# EAGLE design BLE -- HM-10 $ ATtiny85 Combo -- v01 (EAGLE 6.4)
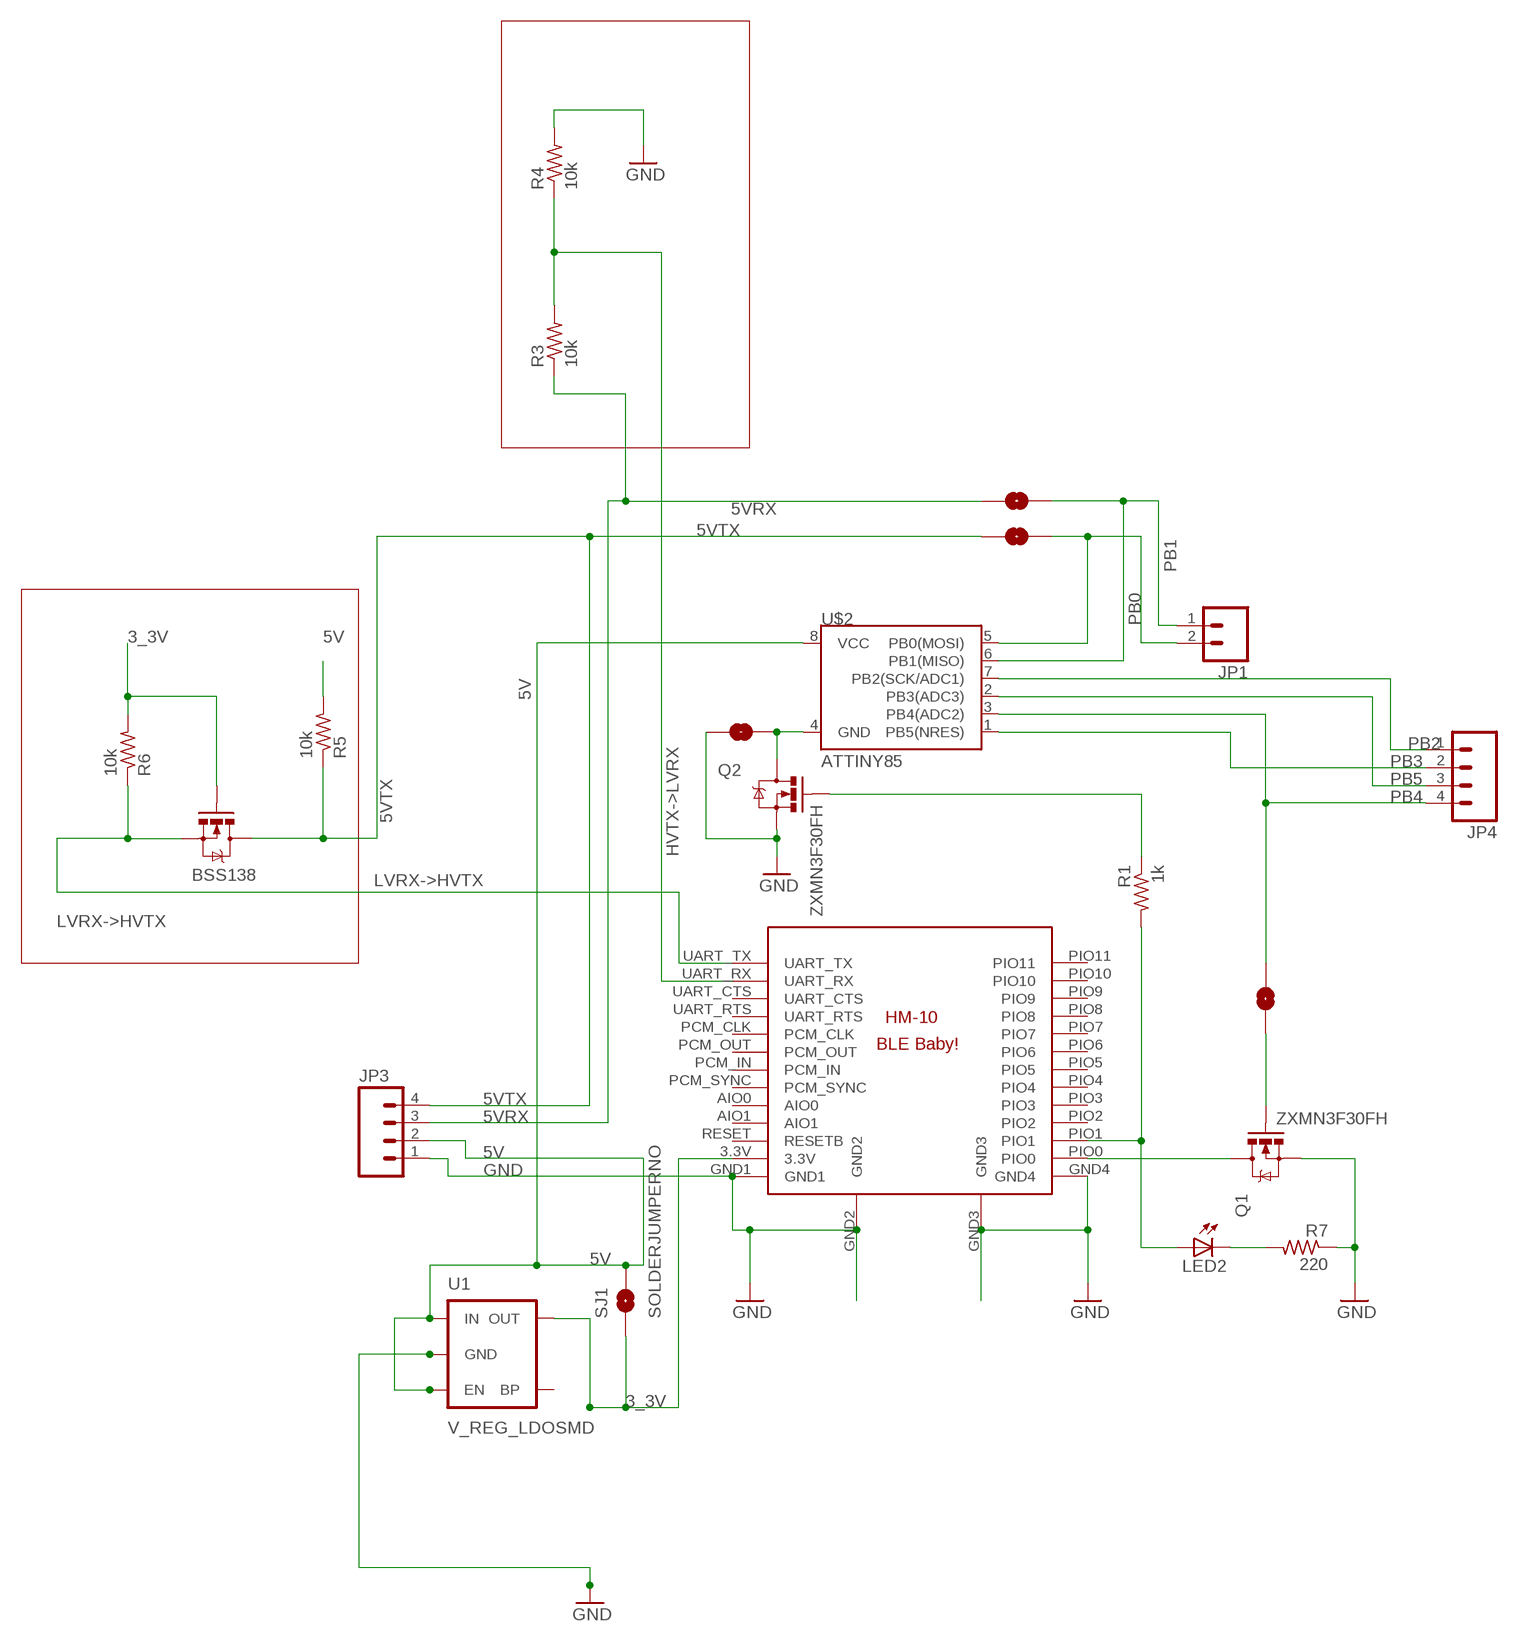
[diagram p0: schematic, sheet 1]

## Parts
BSS138  MOSFET-NCHANNELSMD  [SOT23-3]
JP1  M02PTH  [1X02]
JP3  M04PTH  [1X04]
JP4  M04PTH  [1X04]
LED2  LED0603  [LED-0603]
Q1  ZXMN3F30FH  MOSFET-NCHANNELSMD  [SOT23-3]
Q2  ZXMN3F30FH  MOSFET-NCHANNELSMD  [SOT23-3]
R1  1k  R-US_R0402  [R0402]
R3  10k  R-US_R0402  [R0402]
R4  10k  R-US_R0402  [R0402]
R5  10k  R-US_R0402  [R0402]
R6  10k  R-US_R0402  [R0402]
R7  220  R-US_R0402  [R0402]
SJ1  SOLDERJUMPERNO  [SJ_2S-NO]
SJ2  SOLDERJUMPERNO  [SJ_2S-NO]
SJ3  SOLDERJUMPERNO  [SJ_2S-NO]
SJ4  SOLDERJUMPERNO  [SJ_2S-NO]
SJ5  SOLDERJUMPERNO  [SJ_2S-NO]
U1  V_REG_LDOSMD  [SOT23-5]
U$1  BLE-HM10_NO_SPI  [BLE-HM10_NO_SPI]
U$2  ATTINY85  ATTINY45  [SO08-EIAJ]

## Nets
3_3V: BSS138.1(G) R6.2 SJ1.1 U1.5(OUT) U$1.3.3V
5V: JP3.2 R5.2 SJ1.2 U1.1(IN) U1.3(EN) U$2.8(VCC)
5VRX: JP3.3 R3.1 SJ3.2
5VTX: BSS138.3(D) JP3.4 R5.1 SJ2.2
GND: JP3.1 Q1.2(S) Q2.2(S) R4.2 R7.1 SJ5.1 U1.2(GND) U$1.GND1 U$1.GND2 U$1.GND3 U$1.GND4
HVTX->LVRX: R3.2 R4.1 U$1.UART_RX
LVRX->HVTX: BSS138.2(S) R6.1 U$1.UART_TX
N$1: Q1.1(G) SJ4.2
N$2: Q2.1(G) R1.1
N$3: LED2.A U$1.PIO1
N$12: Q2.3(D) SJ5.2 U$2.4(GND)
N$13: Q1.3(D) U$1.PIO0
N$26: LED2.C R7.2
PB0: JP1.2 SJ2.1 U$2.5(PB0(MOSI))
PB1: JP1.1 SJ3.1 U$2.6(PB1(MISO))
PB2: JP4.1 U$2.7(PB2(SCK/ADC1))
PB3: JP4.3 U$2.2(PB3(ADC3))
PB4: JP4.4 SJ4.1 U$2.3(PB4(ADC2))
PB5: JP4.2 U$2.1(PB5(NRES))
Unconnected: R1.2 U1.4(BP) U$1.AIO0 U$1.AIO1 U$1.PCM_CLK U$1.PCM_IN U$1.PCM_OUT U$1.PCM_SYNC U$1.PIO2 U$1.PIO3 U$1.PIO4 U$1.PIO5 U$1.PIO6 U$1.PIO7 U$1.PIO8 U$1.PIO9 U$1.PIO10 U$1.PIO11 U$1.RESET(RESETB) U$1.UART_CTS U$1.UART_RTS

## Library data of the parts
BSS138 Q1 Q2 = SparkFun:MOSFET-NCHANNEL
JP1 = SparkFun:M02: Header 2 Standard 2-pin 0.1" header. Use with straight break away headers (SKU : PRT-00116), right angle break away headers (PRT-00553), swiss pins (PRT-00743), machine pins (PRT-00117), and female headers (PRT-00115). Molex polarized connector foot print use with SKU : PRT-08233 with associated crimp pins and housings.
JP3 JP4 = SparkFun:M04: Header 4 Standard 4-pin 0.1" header. Use with straight break away headers (SKU : PRT-00116), right angle break away headers (PRT-00553), swiss pins (PRT-00743), machine pins (PRT-00117), and female headers (PRT-00115). Molex polarized connector foot print use with SKU : PRT-08231 with associated crimp pins and housings. 1MM SMD Version SKU: PRT-10208
LED2 = SparkFun:LED: LEDs Standard schematic elements and footprints for 5mm, 3mm, 1206, and 0603 sized LEDs. 5mm - Spark Fun Electronics SKU : COM-00529 (and others)
R1 R3-R7 = resistor:R-US_: RESISTOR, American symbol
SJ1-SJ5 = SparkFun:SOLDERJUMPER: Solder Jumper Standard SMD solder jumper. Used to automate production. Two varients : Normally Open and Normally Closed are the same, but have different paste layers. NC will have a large amount of paste and should jumper during reflow.
U1 = SparkFun:V_REG_LDO: Voltage Regulator LDO Standard 150mA LDO voltage regulator in SOT-23 layout. Micrel part MIC5205. BP (by-pass) pin is used to lower output noise with 470pF cap.
U$1 = Random parts:BLE-HM10_NO_SPI
U$2 = SparkFun:ATTINY45: Atmel ATTiny45

## Board
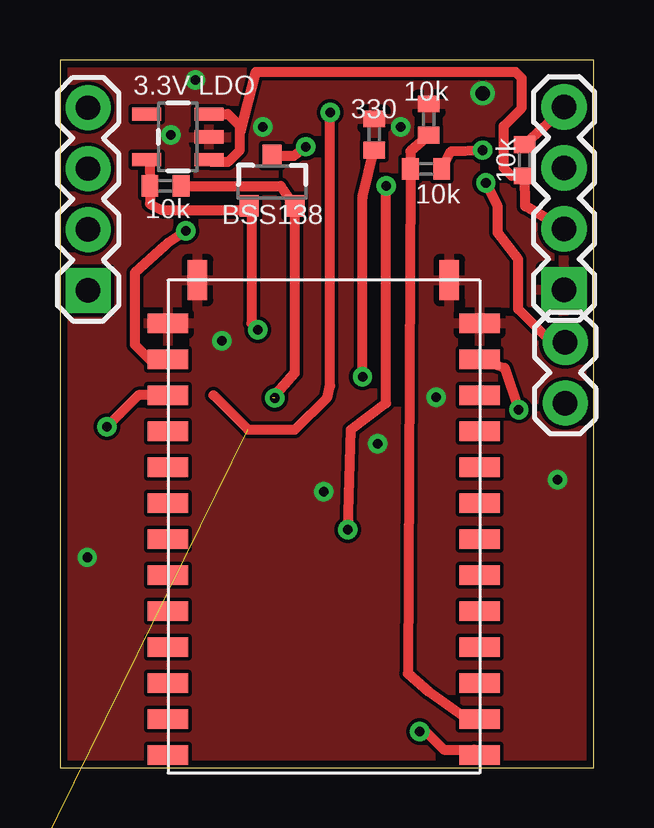
[diagram p1: board, top side]
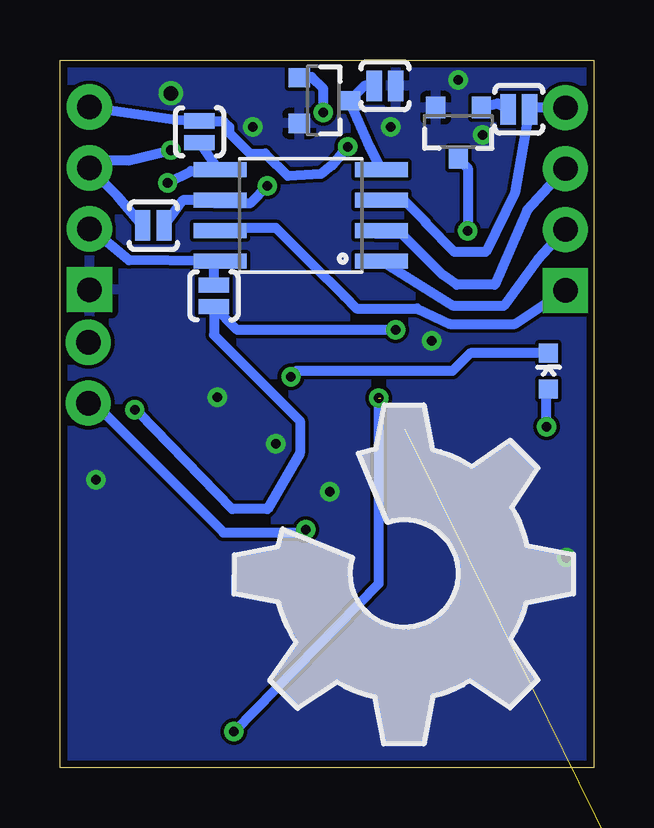
[diagram p2: board, bottom side, seen from below]

Size 22.25 x 29.5 mm. Coordinates in mm from the lower left corner, seen from the top.
Outline: 0,0 22.25,0 22.25,29.5 0,29.5 0,0
Copper layers (1*16): Top 0.035mm / dielectric 1.5mm / Bottom 0.035mm
Design rules "default *": minimum track width 10mil, minimum drill 24mil, track to track 6mil, track to pad 6mil, pad to pad 6mil, via to via 6mil, smd to smd 6mil, copper to edge 12mil, drill to drill 8mil, minimum pad ring 10mil, minimum via ring 8mil, stop-mask expansion 4mil, vias tented up to drill 0.6mm, thermal gap 10mil

### Footprints (pad centres in the part's own frame; a part is rotated, then mirrored left to right if it is on the bottom)
SOT23-3 = smd 0.8 x 0.9: 1 -0.95,-1; 2 0.95,-1; 3 0,1.1
1X02 = drill 1.016 pad 1.88: 1 0,0; 2 2.54,0
1X04 = drill 1.016 pad 1.88 square: 1 0,0 | drill 1.016 pad 1.88: 2 2.54,0; 3 5.08,0; 4 7.62,0
LED-0603 = smd 0.8 x 0.8: A 0,-0.75; C 0,0.75
R0402 = smd 0.7 x 0.9: 1 -0.65,0; 2 0.65,0
SJ_2S-NO = smd 0.635 x 1.27: 1 -0.45,0; 2 0.45,0
SOT23-5 = smd 0.55 x 1.2: 1 -0.95,-1.3; 2 0,-1.3; 3 0.95,-1.3; 4 0.95,1.3; 5 -0.95,1.3
BLE-HM10_NO_SPI = smd 1.676 x 0.813: 3.3V 0,-17.03; AIO0 0,-12.53; AIO1 0,-14.03; GND1 0,-18.53; GND4 13,-18.53; PCM_CLK 0,-6.53; PCM_IN 0,-9.53; PCM_OUT 0,-8.03; PCM_SYNC 0,-11.03; PIO0 13,-17.03; PIO1 13,-15.53; PIO2 13,-14.03; PIO3 13,-12.53; PIO4 13,-11.03; PIO5 13,-9.53; PIO6 13,-8.03; PIO7 13,-6.53; PIO8 13,-5.03; PIO9 13,-3.53; PIO10 13,-2.03; PIO11 13,-0.53; RESET 0,-15.53; UART_CTS 0,-3.53; UART_RTS 0,-5.03; UART_RX 0,-2.03; UART_TX 0,-0.53 | smd 0.813 x 1.676: GND2 1.27,-20.32; GND3 11.77,-20.32
SO08-EIAJ = smd 0.61 x 2.21: 1 -1.905,-3.378; 2 -0.635,-3.378; 3 0.635,-3.378; 4 1.905,-3.378; 5 1.905,3.353; 6 0.635,3.353; 7 -0.635,3.353; 8 -1.905,3.353

### Placement (x,y rotation side)
BSS138  8.84,24.41 0 top
JP1  21.07,15.19 90 top
JP3  21.02,19.92 90 top
JP4  1.17,19.89 90 top
LED2  1.88,16.53 0 bottom
Q1  5.63,26.52 180 bottom
Q2  11.27,27.81 270 bottom
R1  -0.73,-4.66 0 top  (outside the outline)
R3  15.27,24.95 180 top
R4  15.38,27.02 90 top
R5  19.38,25.32 270 top
R6  4.4,24.25 180 top
R7  13.1,26.39 270 top
SJ1  15.83,19.67 90 bottom
SJ2  16.43,26.5 90 bottom
SJ3  18.36,22.59 180 bottom
SJ4  3.12,27.44 180 bottom
SJ5  8.7,28.42 180 bottom
U1  4.92,26.29 90 top
U$1  17.5,0 180 top
U$2  12.21,23.02 90 bottom
U$3  [OSHW_FILLX500_NOTEXT]  6.86,17.03 225 bottom

### Tracks (layer width: path | path; a pad name or v marks a point on that pad's centre or on a via)
3_3V  (via drill 0.4)
  Top 0.254: v19.13,14.92 arc90 19.11,14.95 18.99,14.95
  Top 0.406: U1.5 3.74,25.23 R6.2 3.75,23.5 4.25,23.25 7.98,23.25 | 7.98,23.25 BSS138.1 | U$1.3.3V 18.55,16.66 v19.13,14.92 | 7.98,23.25 7.98,18.52 v8.25,18.25
  Bottom 0.254: 18.99,14.82 arc-90 19.21,14.92 v19.13,14.92
  Bottom 0.406: v8.25,18.25 14.86,18.25 SJ1.1 15.83,18.04 12.25,14.46 12.25,13.11 13.6,10.78 15.07,10.78 18.99,14.82
5V
  Top 0.406: U1.3 7.01,27.24 7.5,26.75 7.5,26.5 | U1.1 6.31,25.25 7,25.25 7.5,25.75 7.5,26.5 | JP3.2 19.4,23.4 R5.2 18.83,24.67 18.5,25 18.5,26.75 19.25,27.5 19.25,28.75 19,29 8.16,29 7.5,26.5
  Bottom 0.406: SJ1.2 15.83,21.01 U$2.8 16.03,21.11 19.38,21.15 20.98,22.5 JP3.2
5VRX  (via drill 0.4)
  Top 0.406: R3.1 16.31,25.69 v17.62,25.74
  Bottom 0.406: SJ3.2 19.84,23.82 JP3.3 20.71,25.31 19.42,25.31 v17.62,25.74
5VTX  (via drill 0.4)
  Top 0.406: BSS138.3 9.76,25.51 v10.26,25.88 | R5.1 20.2,26.72 JP3.4
  Bottom 0.406: JP3.4 17.41,27.02 SJ2.2 15.44,26.95 15.19,26.7 15.19,26.46 14.33,25.6 13.7,25.6 12.75,24.66 11.37,24.75 10.9,25.11 v10.26,25.88
GND  (via drill 0.4, 0.6)
  other vias: 17.62,28.11 4.63,26.37 1.14,8.76 20.75,12 13.25,13.5 11,11.5 15.69,15.44 8.46,26.71 14.21,26.71 5.64,28.67 6.75,17.79
  pour Bottom: 0,28.5 -0.25,28.5 -0.25,0 22.25,0 22.25,29.5 0,29.5
  pour Top: 0,28.25 -0.25,28.25 -0.25,-0.25 22.25,-0.25 22.25,29.5 0,29.5
HVTX->LVRX
  Top 0.406: R4.1 14.61,25.7 R3.2 14.62,24.71 14.5,3.92 15.38,3.16 | U$1.UART_RX 16.97,2.03 15.38,3.16 | 15.38,3.16 15.24,3.27
LVRX->HVTX  (via drill 0.4)  (1 unrouted)
  Top 0.406: R6.1 9.2,24.25 BSS138.2 9.79,16.44 8.87,15.4 | v15,1.5 15.25,1.5 16,0.75 17.28,0.75 U$1.UART_TX
  Bottom 0.406: v8.96,15.41 8.96,7.66 v15,1.5
N$1
  Bottom 0.406: SJ4.2 4,27.69 Q1.1
N$2  (via drill 0.4)  (1 unrouted)
  Top 0.406: 6.4,15.53 7.84,14.09 9.8,14.09 11.15,15.44 11.27,15.93 v11.27,27.32
  Bottom 0.406: v11.27,27.32 11.27,28.3 11.76,28.79 12.24,28.79 Q2.1
N$3  (via drill 0.4)
  Top 0.406: U$1.PIO1 3.28,15.53 v1.96,14.21
  Bottom 0.406: v1.96,14.21 1.96,15.7 LED2.A
N$12
  Bottom 0.406: U$2.4 9.32,25.86 Q2.3 | Q2.3 10.05,27.81 | SJ5.2 9.55,28.42 Q2.3
N$13  (via drill 0.4)
  Top 0.406: v5.25,22.38 4.5,21.88 4.38,21.75 3.13,20.63 3.13,17.62 3.72,17.03 U$1.PIO0
  Bottom 0.406: Q1.3 5.24,24.99 v5.25,22.38
N$26  (via drill 0.4)
  Top 0.406: v12.62,16.29 12.62,23.77 R7.2
  Bottom 0.406: LED2.C 5.14,17.28 5.88,16.54 12.37,16.54 v12.62,16.29
PB0  (via drill 0.4)
  Top 0.406: JP1.2 20.49,17.73 19.11,19.11 19.11,21.19 18.25,22.3 18.25,23.4 v17.76,24.38
  Bottom 0.406: SJ2.1 15.77,25.09 U$2.5 15.99,24.87 16.78,24.87 v17.76,24.38
PB1  (via drill 0.4)
  Top 0.406: v12.01,9.92 12.13,14.09 13.6,15.19 v13.6,24.25
  Bottom 0.406: SJ3.1 17.13,23.66 U$2.6 15.8,23.52 14.33,23.52 v13.6,24.25 | JP1.1 20.82,15.19 15.44,9.8 12.25,9.8 v12.01,9.92
PB2
  Bottom 0.406: JP4.1 3.28,18.5 6,18.5 7.36,19.14 9.89,19.14 10.39,19.65 11.75,21 13.25,22.5 15.82,22.5 U$2.7
PB3
  Bottom 0.406: JP4.3 2.78,23.22 4.12,20.13 5.7,20.13 6.32,20.57 8,22.25 9.07,22.25 U$2.2
PB4
  Bottom 0.406: JP4.4 2.42,27.51 SJ4.1 3.28,23.97 4.5,21.5 5.8,21.5 7,22.7 7,22.75 7.91,23.66 U$2.3
PB5
  Bottom 0.406: JP4.2 2.32,21.18 3.75,19.25 5.84,19.25 U$2.1

### Text on the board
_tsilk: 3.3V LDO | 10k | 330 | 10k | 10k | 10k | BSS138
_bsilk: RES ON | CON ON | PB0& / HM10TX | TX | NCHAN | RX | PB3 | PB4 | VIN | PB5 | GND | PB2 | VREG / BYPASS | CONN | PB0 | PB1 | PB1& / HM10RX | ATtiny 85 & HM-10 v.01 / Thomas Brittain / letsmakerobots.com